# EAGLE design sensor_board008 (EAGLE 4.16)

## Sheet 1 of 2
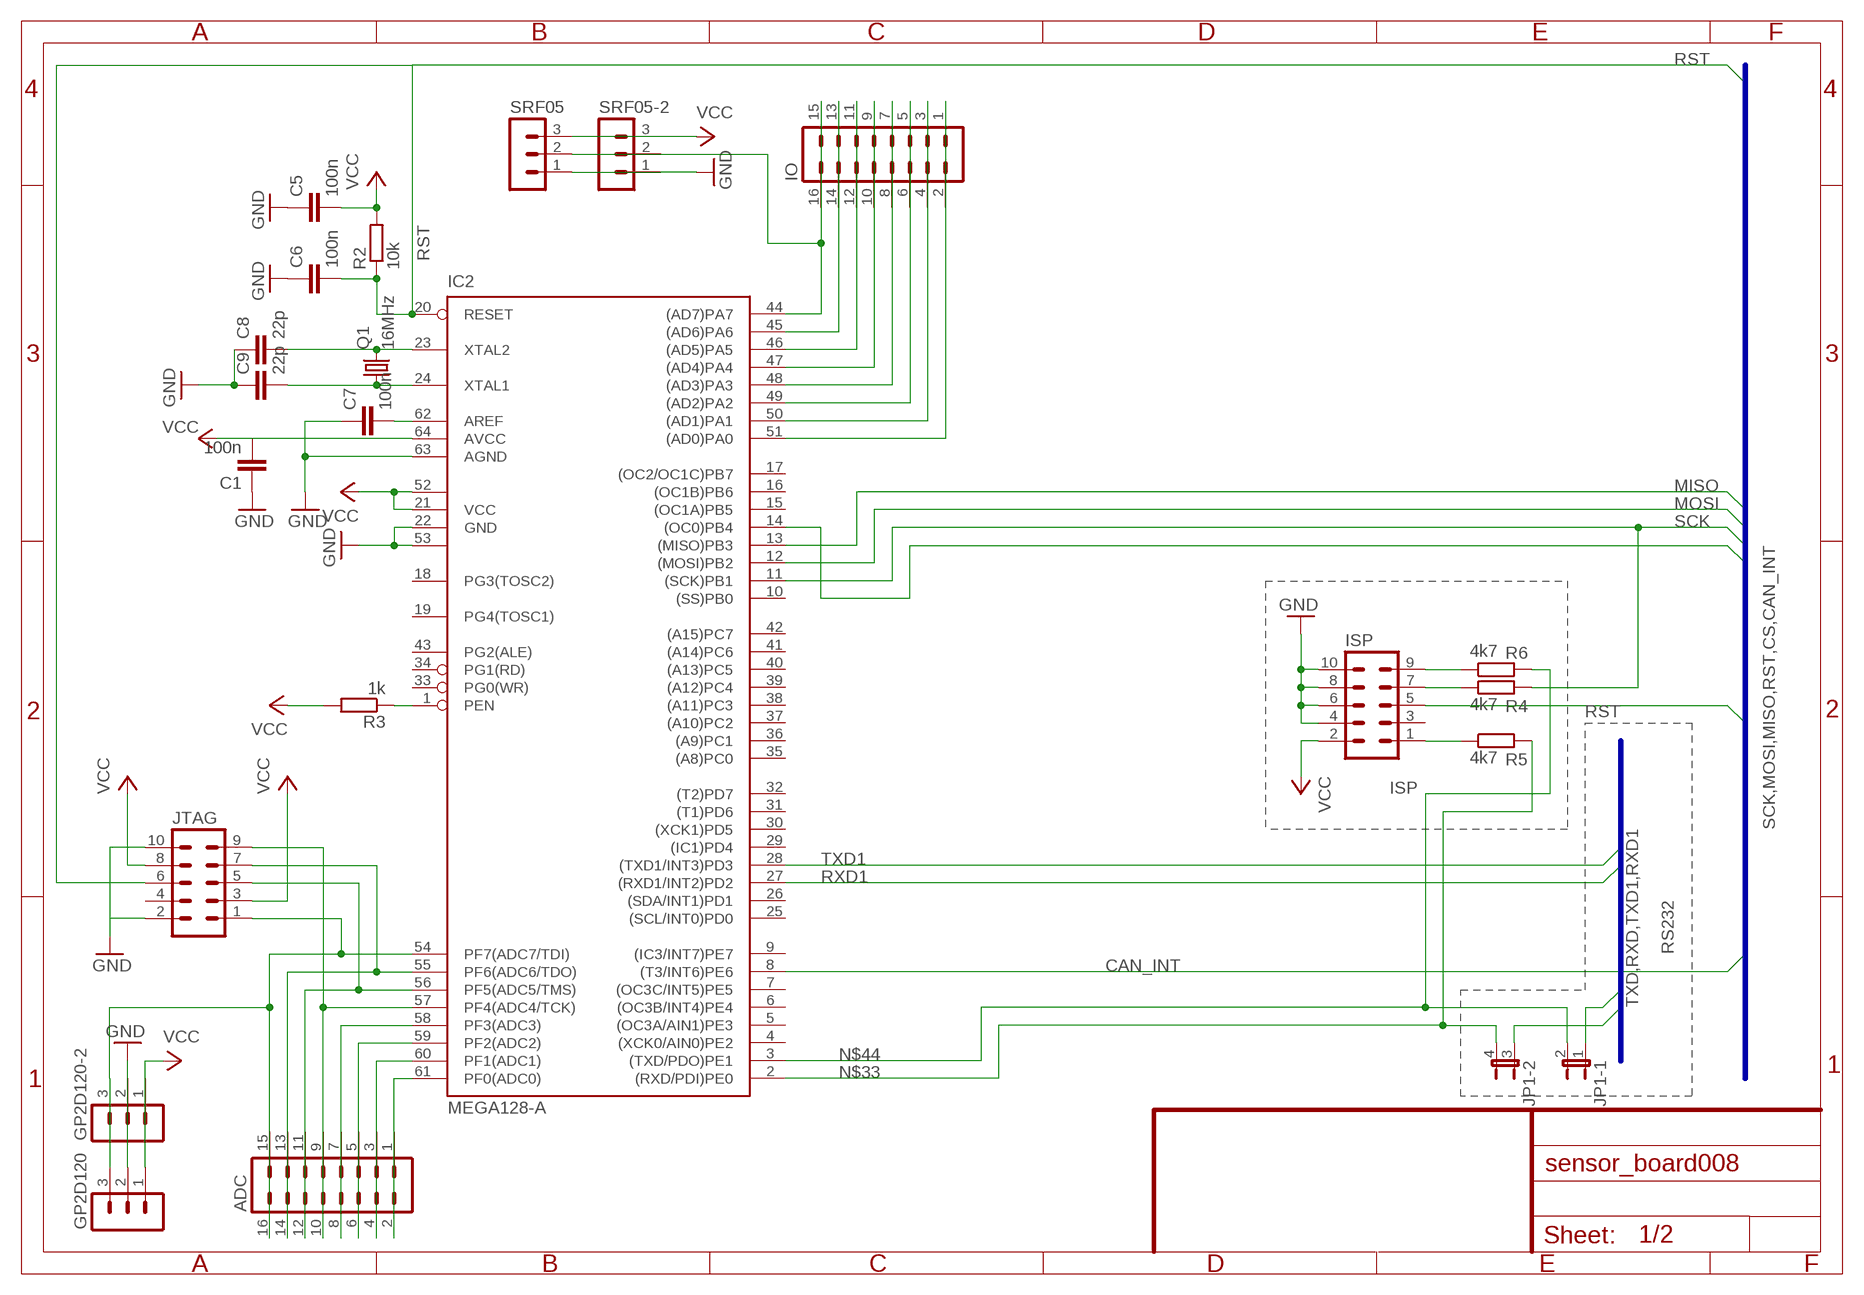
[diagram p0: schematic, sheet 1]

### Parts
ADC  MA08-2  [MA08-2]
C1  100n  C-EUC0603  [C0603]
C5  100n  C-EUC0603  [C0603]
C6  100n  C-EUC0603  [C0603]
C7  100n  C-EUC0603  [C0603]
C8  22p  C-EUC0603  [C0603]
C9  22p  C-EUC0603  [C0603]
GP2D120  MA03-1  [MA03-1]
GP2D120-2  MA03-1  [MA03-1]
IC2  MEGA128-A  [TQFP64]
IO  MA08-2  [MA08-2]
ISP  MA05-2  [MA05-2]
JP1  JP2QE  [JP2Q]
JTAG  MA05-2  [MA05-2]
Q1  16MHz  CRYSTALHC49U-V  [HC49U-V]
R2  10k  R-EU_R0805  [R0805]
R3  1k  R-EU_R0805  [R0805]
R4  4k7  R-EU_R0805  [R0805]
R5  4k7  R-EU_R0805  [R0805]
R6  4k7  R-EU_R0805  [R0805]
SRF05  MA03-1  [MA03-1]
SRF05-2  MA03-1  [MA03-1]

### Nets
CAN_INT: IC2.8((T3/INT6)PE6) ; also sheet 2
CS: IC2.14((OC0)PB4) ; also sheet 2
GND: C1.1 C5.1 C6.1 C7.1 C8.1 C9.1 GP2D120-2.2 GP2D120.2 IC2.22(GND) IC2.53(GND1) IC2.63(AGND) ISP.4 ISP.6 ISP.8 ISP.10 JTAG.2 JTAG.10 SRF05-2.1 SRF05.1 ; also sheet 2
MISO: IC2.13((MISO)PB3) ; also sheet 2
MOSI: IC2.12((MOSI)PB2) ; also sheet 2
N$1: ADC.1 ADC.2 IC2.61(PF0(ADC0))
N$3: ADC.3 ADC.4 IC2.60(PF1(ADC1))
N$4: ADC.5 ADC.6 IC2.59(PF2(ADC2))
N$5: C7.2 IC2.62(AREF)
N$6: C9.2 IC2.24(XTAL1) Q1.1
N$7: C8.2 IC2.23(XTAL2) Q1.2
N$9: ADC.7 ADC.8 IC2.58(PF3(ADC3))
N$11: ADC.9 ADC.10 IC2.57(PF4(ADC4/TCK)) JTAG.9
N$14: ADC.11 ADC.12 IC2.56(PF5(ADC5/TMS)) JTAG.5
N$15: ADC.13 ADC.14 IC2.55(PF6(ADC6/TDO)) JTAG.7
N$19: ADC.15 ADC.16 GP2D120-2.3 GP2D120.3 IC2.54(PF7(ADC7/TDI)) JTAG.1
N$20: IC2.45((AD6)PA6) IO.13 IO.14
N$22: ISP.9 R6.1
N$24: IC2.46((AD5)PA5) IO.11 IO.12
N$25: ISP.1 R5.1
N$26: IC2.1(PEN) R3.1
N$28: IC2.47((AD4)PA4) IO.9 IO.10
N$29: ISP.7 R4.1
N$31: IC2.48((AD3)PA3) IO.7 IO.8
N$32: IC2.49((AD2)PA2) IO.5 IO.6
N$33: IC2.2((RXD/PDI)PE0) JP1.4 R5.2
N$34: IC2.50((AD1)PA1) IO.3 IO.4
N$35: IC2.51((AD0)PA0) IO.1 IO.2
N$44: IC2.3((TXD/PDO)PE1) JP1.2 R6.2
N$47: IC2.44((AD7)PA7) IO.15 IO.16 SRF05-2.2 SRF05.2
RST: C6.2 IC2.20(RESET) ISP.5 JTAG.6 R2.1 ; also sheet 2
RXD: JP1.3 ; also sheet 2
RXD1: IC2.27((RXD1/INT2)PD2) ; also sheet 2
SCK: IC2.11((SCK)PB1) R4.2 ; also sheet 2
TXD: JP1.1 ; also sheet 2
TXD1: IC2.28((TXD1/INT3)PD3) ; also sheet 2
VCC: C1.2 C5.2 GP2D120-2.1 GP2D120.1 IC2.21(VCC) IC2.52(VCC1) IC2.64(AVCC) ISP.2 JTAG.3 JTAG.8 R2.2 R3.2 SRF05-2.3 SRF05.3 ; also sheet 2
Unconnected: IC2.4((XCK0/AIN0)PE2) IC2.5((OC3A/AIN1)PE3) IC2.6((OC3B/INT4)PE4) IC2.7((OC3C/INT5)PE5) IC2.9((IC3/INT7)PE7) IC2.10((SS)PB0) IC2.15((OC1A)PB5) IC2.16((OC1B)PB6) IC2.17((OC2/OC1C)PB7) IC2.18(PG3(TOSC2)) IC2.19(PG4(TOSC1)) IC2.25((SCL/INT0)PD0) IC2.26((SDA/INT1)PD1) IC2.29((IC1)PD4) IC2.30((XCK1)PD5) IC2.31((T1)PD6) IC2.32((T2)PD7) IC2.33(PG0(WR)) IC2.34(PG1(RD)) IC2.35((A8)PC0) IC2.36((A9)PC1) IC2.37((A10)PC2) IC2.38((A11)PC3) IC2.39((A12)PC4) IC2.40((A13)PC5) IC2.41((A14)PC6) IC2.42((A15)PC7) IC2.43(PG2(ALE)) ISP.3 JTAG.4

### Buses
SCK,MOSI,MISO,RST,CS,CAN_INT
TXD,RXD,TXD1,RXD1

### Notes on the sheet
- ISP
- RS232

## Sheet 2 of 2
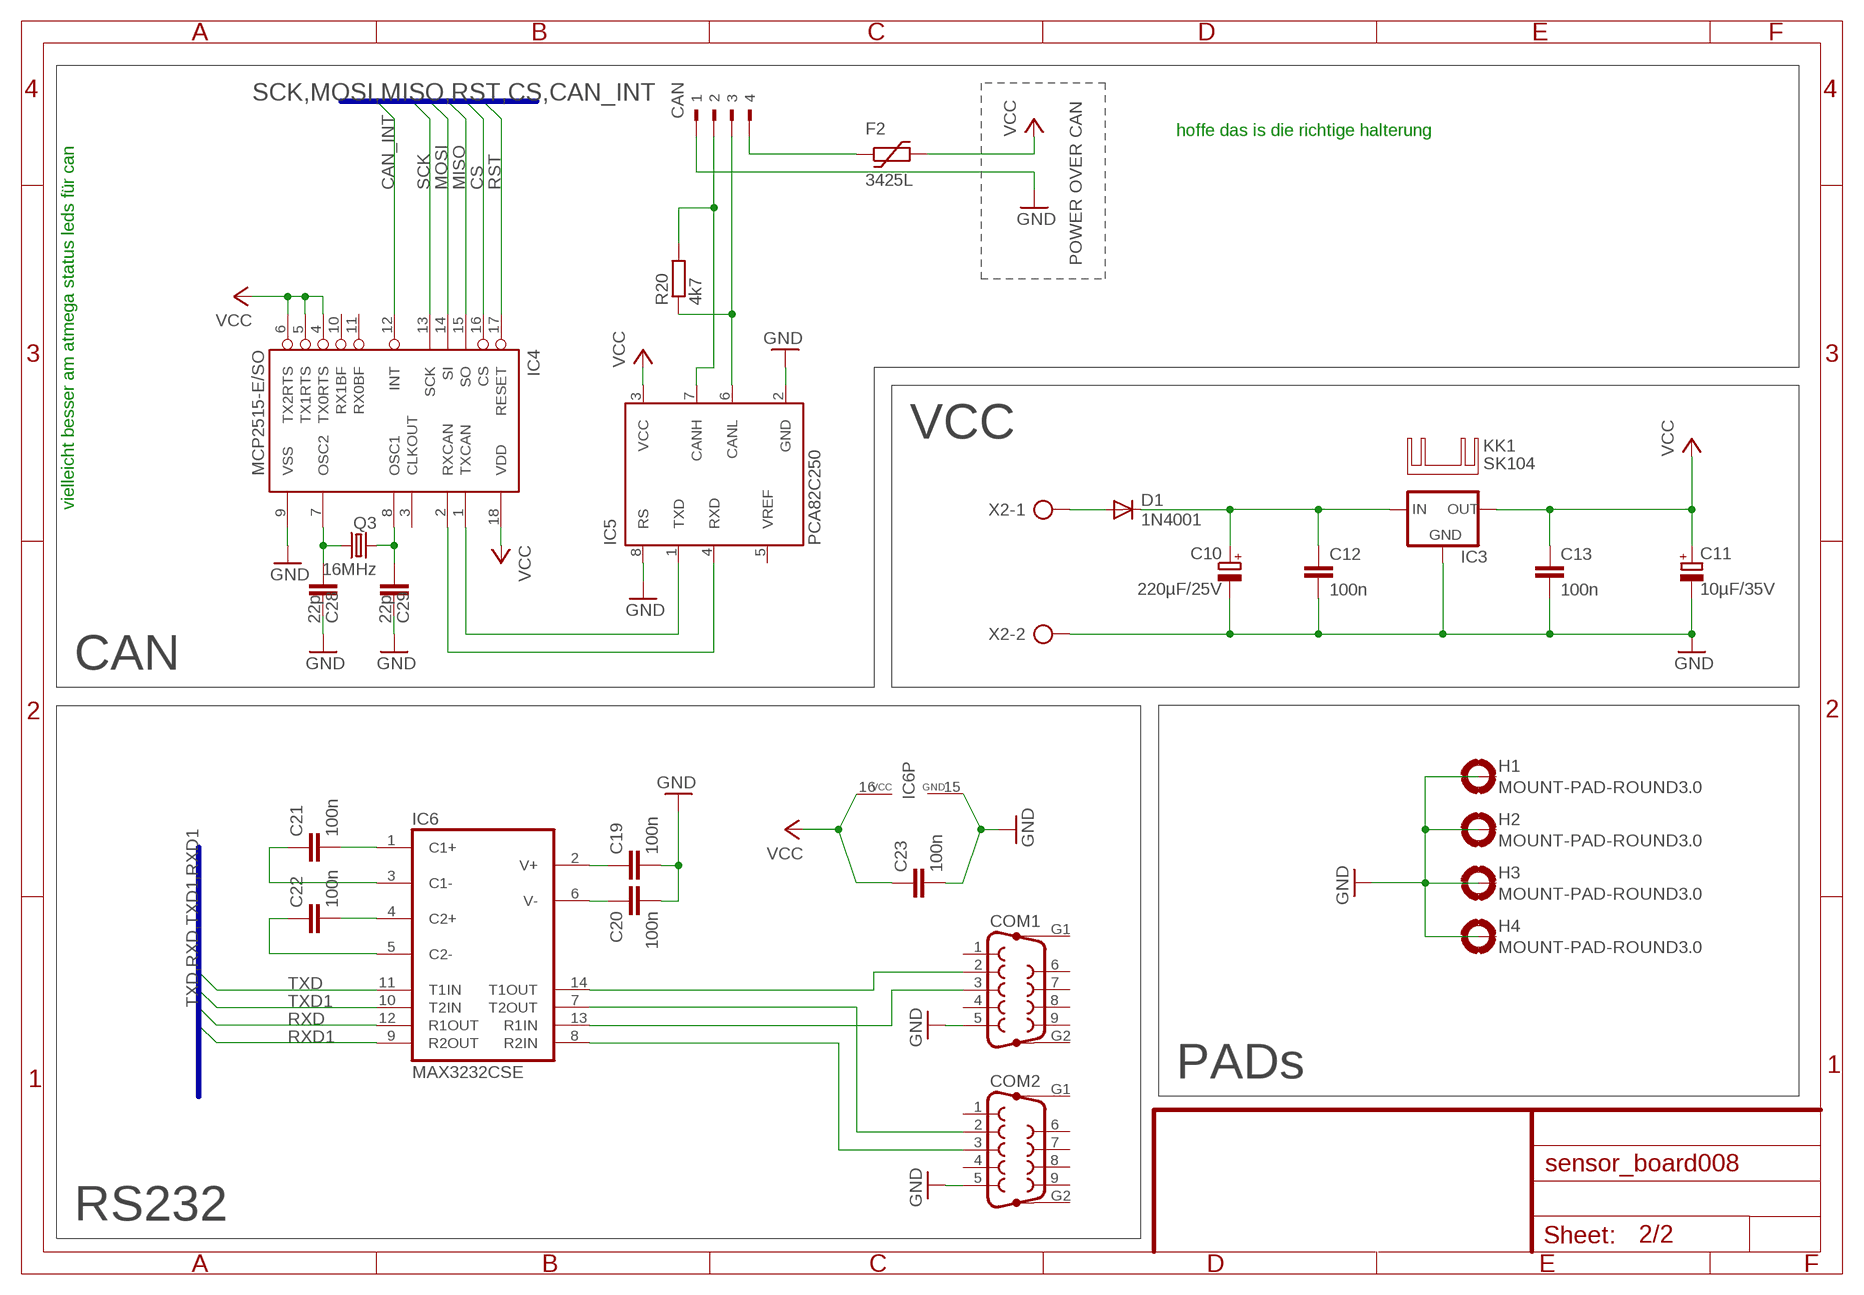
[diagram p1: schematic, sheet 2]

### Parts
C10  220µF/25V  CPOL-EUE3.5-8  [E3,5-8]
C11  10µF/35V  CPOL-EUE2-5  [E2-5]
C12  100n  C-EUC0603  [C0603]
C13  100n  C-EUC0603  [C0603]
C19  100n  C-EUC0603  [C0603]
C20  100n  C-EUC0603  [C0603]
C21  100n  C-EUC0603  [C0603]
C22  100n  C-EUC0603  [C0603]
C23  100n  C-EUC0603  [C0603]
C28  22p  C-EUC0603  [C0603]
C29  22p  C-EUC0603  [C0603]
CAN  90-4  [90-4]
COM1  F09HP  [F09HP]
COM2  F09HP  [F09HP]
D1  1N4001  DIODE-DO41-10  [DO41-10]
F2  3425L  [3425L]
H1  MOUNT-PAD-ROUND3.0  [3,0-PAD]
H2  MOUNT-PAD-ROUND3.0  [3,0-PAD]
H3  MOUNT-PAD-ROUND3.0  [3,0-PAD]
H4  MOUNT-PAD-ROUND3.0  [3,0-PAD]
IC3  78XXS  [78XXS]
IC4  MCP2515-E/SO  [SO18L]
IC5  PCA82C250  [DIL08]
IC6  MAX3232CSE  [SO16]
KK1  SK104  [SK104]
Q3  16MHz  CRYSTALHC49U-V  [HC49U-V]
R20  4k7  R-EU_R0805  [R0805]
X2  AK500/2-H  [AK500/2-H]

### Nets
CAN_INT: IC4.12(INT) ; also sheet 1
CS: IC4.16(CS) ; also sheet 1
GND: C10.- C11.- C12.2 C13.2 C19.2 C20.2 C23.2 C28.2 C29.2 CAN.1 COM1.5 COM2.5 H1.B3,0(MOUNT) H2.B3,0(MOUNT) H3.B3,0(MOUNT) H4.B3,0(MOUNT) IC3.GND IC4.9(VSS) IC5.2(GND) IC5.8(RS) IC6.15(GND) X2.2 ; also sheet 1
MISO: IC4.15(SO) ; also sheet 1
MOSI: IC4.14(SI) ; also sheet 1
N$2: IC4.1(TXCAN) IC5.1(TXD)
N$8: C10.+ C12.1 D1.C IC3.IN
N$10: D1.A X2.1
N$12: COM1.2 IC6.14(T1OUT)
N$13: COM1.3 IC6.13(R1IN)
N$16: CAN.4 F2.P$1
N$17: C21.2 IC6.1(C1+)
N$21: IC4.2(RXCAN) IC5.4(RXD)
N$23: CAN.3 IC5.6(CANL) R20.1
N$30: C22.2 IC6.4(C2+)
N$36: C22.1 IC6.5(C2-)
N$37: C21.1 IC6.3(C1-)
N$40: COM2.2 IC6.7(T2OUT)
N$41: COM2.3 IC6.8(R2IN)
N$43: C19.1 IC6.2(V+)
N$46: C20.1 IC6.6(V-)
N$53: C28.1 IC4.7(OSC2) Q3.1
N$54: C29.1 IC4.8(OSC1) Q3.2
N$59: CAN.2 IC5.7(CANH) R20.2
RST: IC4.17(RESET) ; also sheet 1
RXD: IC6.12(R1OUT) ; also sheet 1
RXD1: IC6.9(R2OUT) ; also sheet 1
SCK: IC4.13(SCK) ; also sheet 1
TXD: IC6.11(T1IN) ; also sheet 1
TXD1: IC6.10(T2IN) ; also sheet 1
VCC: C11.+ C13.1 C23.1 F2.P$2 IC3.OUT IC4.4(TX0RTS) IC4.5(TX1RTS) IC4.6(TX2RTS) IC4.18(VDD) IC5.3(VCC) IC6.16(VCC) ; also sheet 1
Unconnected: COM1.1 COM1.4 COM1.6 COM1.7 COM1.8 COM1.9 COM1.G1 COM1.G2 COM2.1 COM2.4 COM2.6 COM2.7 COM2.8 COM2.9 COM2.G1 COM2.G2 IC4.3(CLKOUT) IC4.10(RX1BF) IC4.11(RX0BF) IC5.5(VREF)

### Buses
SCK,MOSI,MISO,RST,CS,CAN_INT
TXD,RXD,TXD1,RXD1

### Notes on the sheet
- POWER OVER CAN
- hoffe das is die richtige halterung
- VCC
- vielleicht besser am atmega status leds für can
- CAN
- PADs
- RS232

## Library data of the parts
ADC IO = con-lstb:MA08-2: PIN HEADER
C1 C5-C9 C12 C13 C19-C23 C28 C29 = rcl:C-EU: CAPACITOR, European symbol
C10 C11 = rcl:CPOL-EU: POLARIZED CAPACITOR, European symbol
CAN = con-weidmueller-sl35:90-4: WEIDMUELLER CLAMP CONNECTOR
COM1 COM2 = con-subd:F09HP: SUB-D
D1 = diode:DIODE-: DIODE
F2 = ptc-littlefuse:3425L
GP2D120 GP2D120-2 SRF05 SRF05-2 = con-lstb:MA03-1: PIN HEADER
H1-H4 = holes:MOUNT-PAD-ROUND: MOUNTING PAD, round
IC2 = atmel:MEGA128: MICROCONTROLLER 128 Kbytes FLASH 4 Kbytes SRAM 4 Kbytes EEPROM DUAL USART 8-channel 10 bit ADC Source: avr.lbr
IC3 = v-reg:78XXS: VOLTAGE REGULATOR
IC4 = mcp2515:MCP2515
IC5 = micro-philips:PCA82C250: CAN CONTROLLER INTERFACE
IC6 = maxim:MAX3232*: True RS-232 Transceivers 3.0V to 5.5V, Low-Power up to 1Mbps, Using Four 0.1µF External Capacitors Source: http://pdfserv.maxim-ic.com/en/ds/MAX3222-MAX3241.pdf
ISP JTAG = con-lstb:MA05-2: PIN HEADER
JP1 = jumper:JP2QE: JUMPER
KK1 = heatsink:SK104: HEATSINK manufacturer Fischer/distributor Buerklin
Q1 Q3 = crystal:CRYSTAL: CRYSTAL
R2-R6 R20 = rcl:R-EU_: RESISTOR, European symbol
X2 = con-ptr500:AK500/2-H: CONNECTOR Aug. 2004 / PTR Meßtechnik: Die Bezeichnung der Serie AK505 wurde geändert. Es handelt sich hierbei um AK500 in horizontaler Ausführung.

## Board
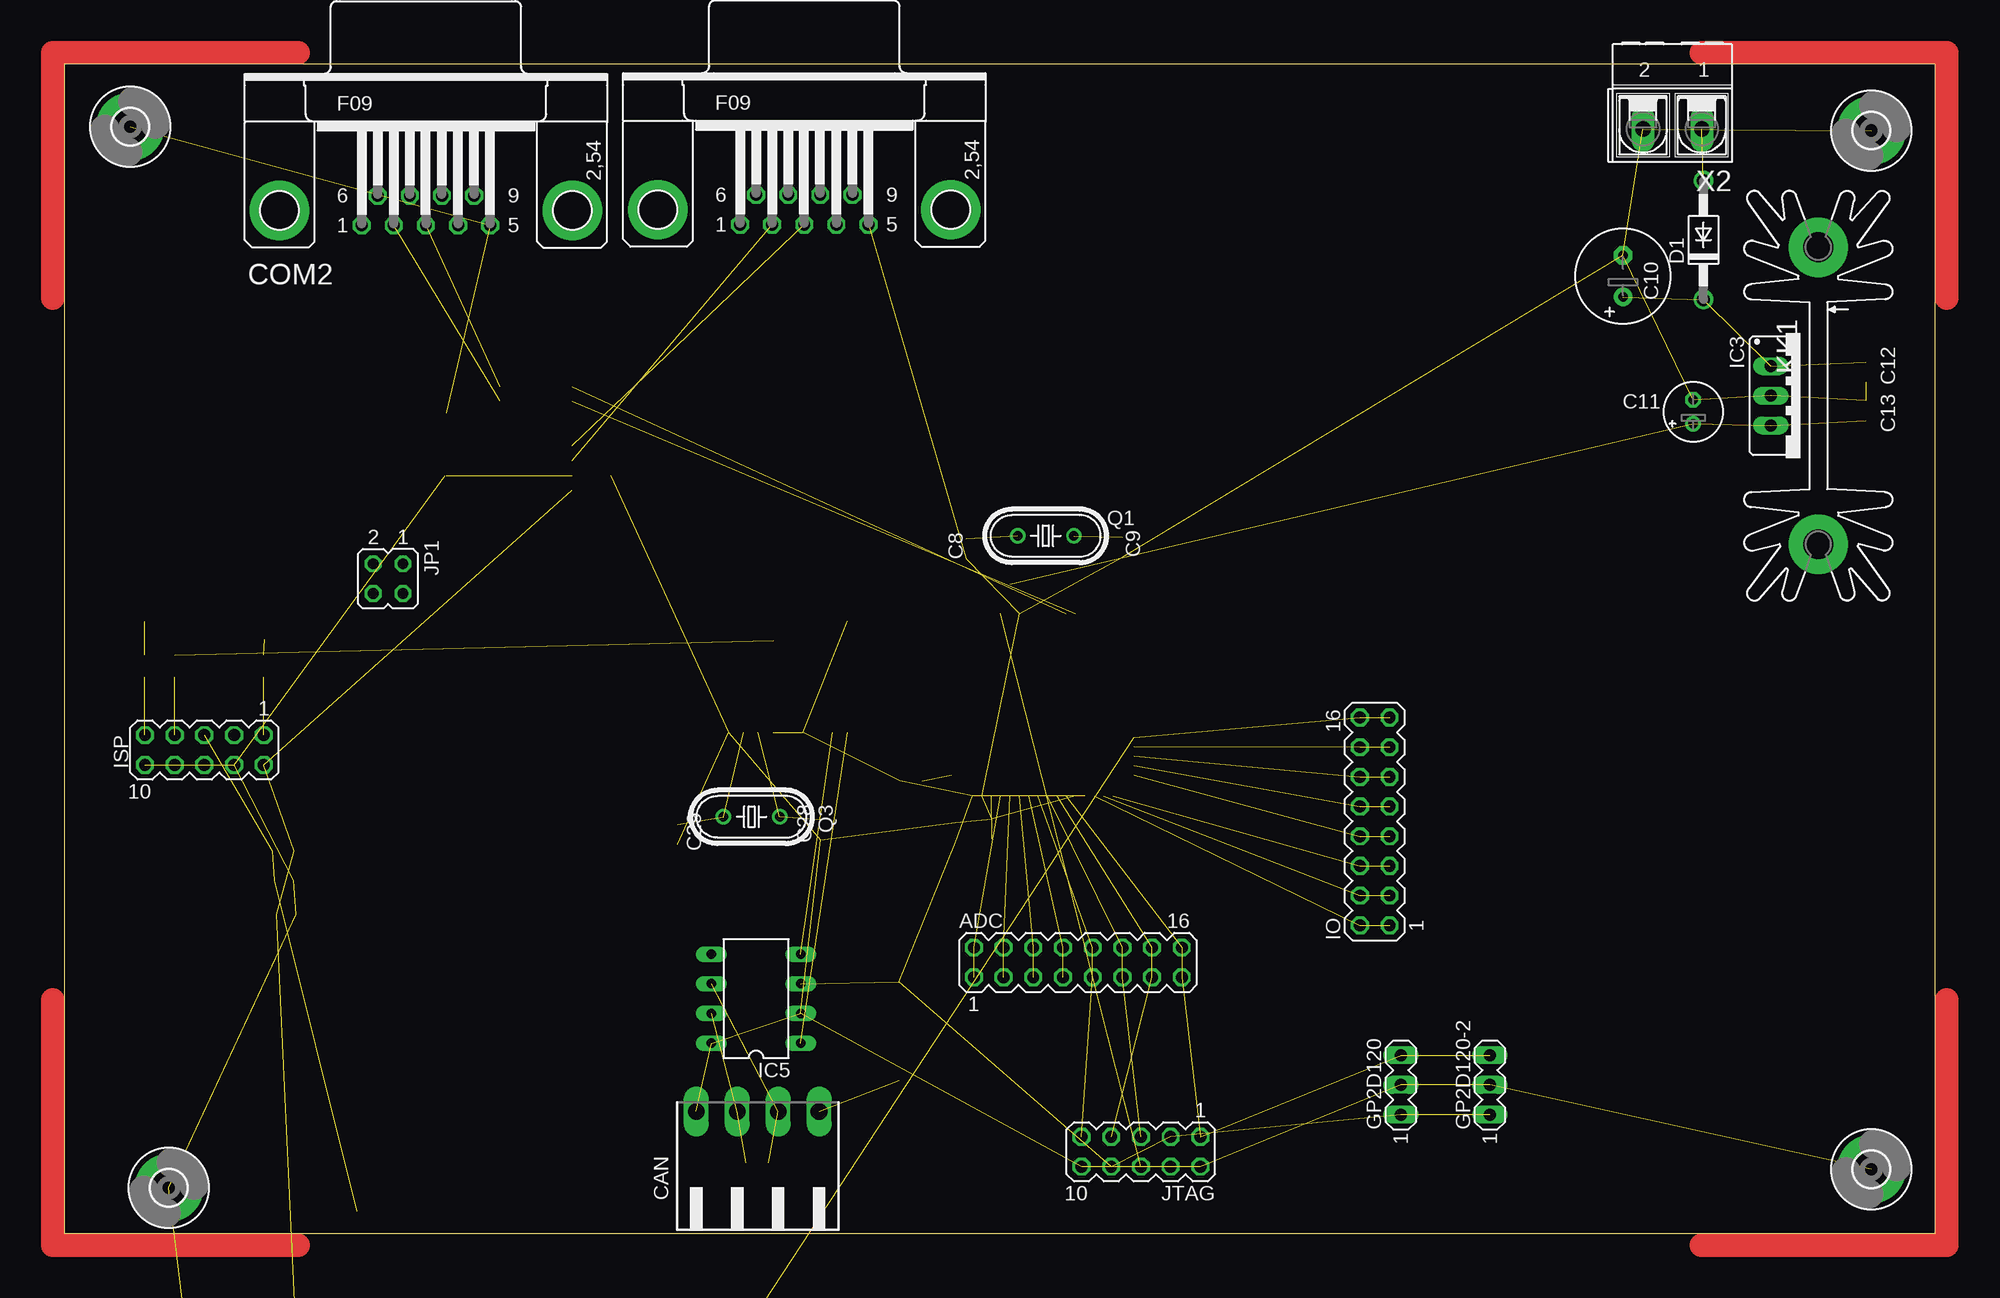
[diagram p2: board, top side]
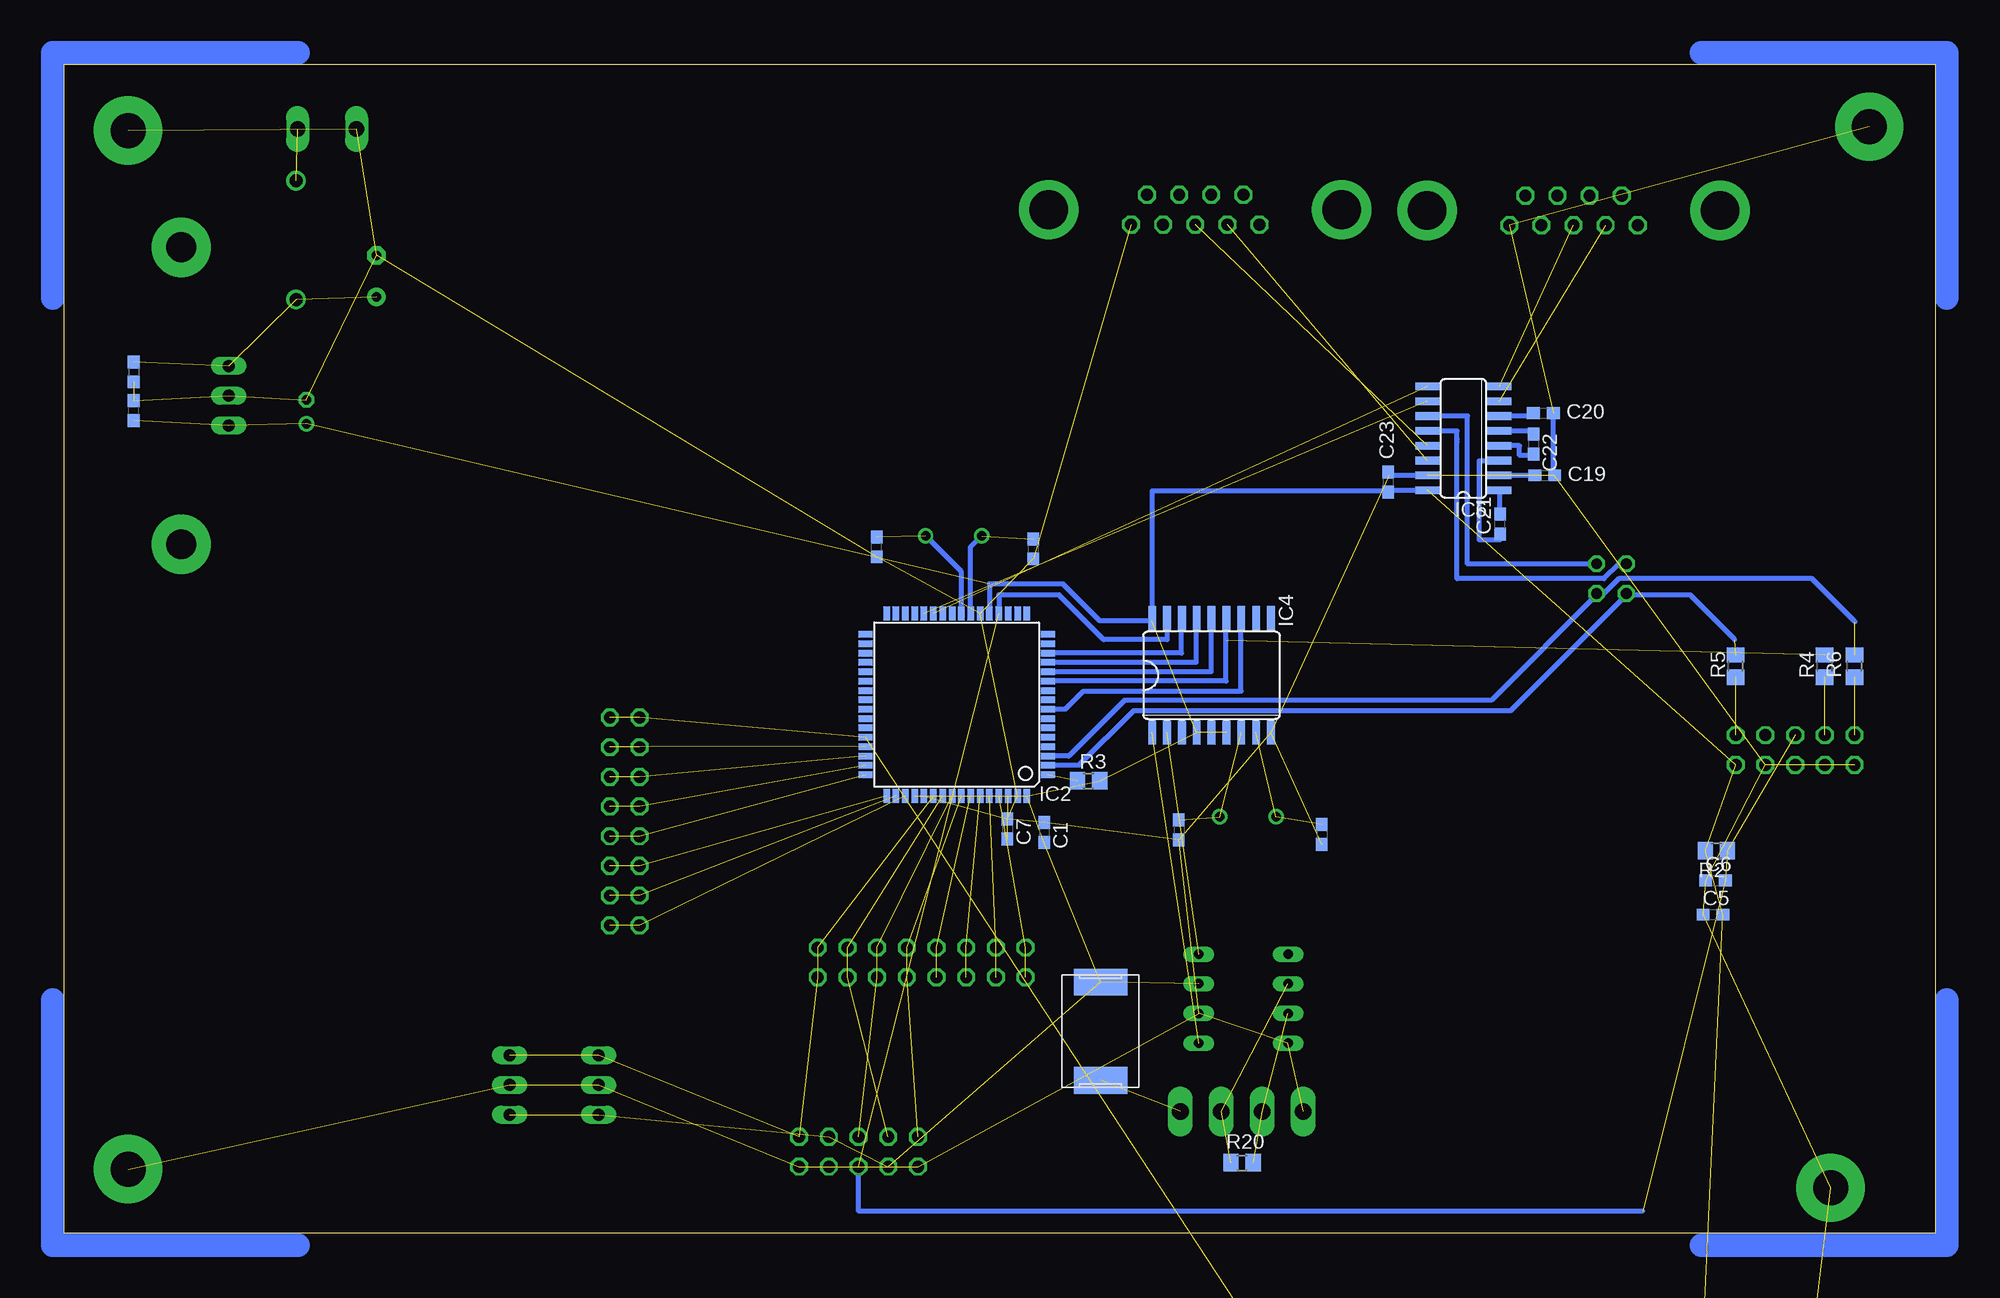
[diagram p3: board, bottom side, seen from below]

Size 160 x 100 mm. Coordinates in mm from the lower left corner, seen from the top.
Outline: 0,0 160,0 160,100 0,100 0,0
Copper layers (1*16): Top 0.035mm / dielectric 1.5mm / Bottom 0.035mm
Design rules "olimex_8mils": minimum track width 10mil, minimum drill 24mil, track to track 8mil, track to pad 8mil, pad to pad 8mil, via to via 8mil, smd to smd 8mil, copper to edge 40mil, drill to drill 10mil, minimum pad ring 10mil, minimum via ring 8mil, stop-mask expansion 0mil, vias tented up to drill 0mil, thermal gap 10mil

### Footprints (pad centres in the part's own frame; a part is rotated, then mirrored left to right if it is on the bottom)
MA08-2 = drill 1.016 octagon: 1 -8.89,-1.27; 2 -8.89,1.27; 3 -6.35,-1.27; 4 -6.35,1.27; 5 -3.81,-1.27; 6 -3.81,1.27; 7 -1.27,-1.27; 8 -1.27,1.27; 9 1.27,-1.27; 10 1.27,1.27; 11 3.81,-1.27; 12 3.81,1.27; 13 6.35,-1.27; 14 6.35,1.27; 15 8.89,-1.27; 16 8.89,1.27
C0603 = smd 1.1 x 1: 1 -0.85,0; 2 0.85,0
E3,5-8 = drill 0.813 pad 1.6 round: + -1.778,0 | drill 0.813 pad 1.6 octagon: - 1.778,0
E2-5 = drill 0.813 pad 1.27 round: + -1.016,0 | drill 0.813 pad 1.27 octagon: - 1.016,0
90-4 = drill 1.422 long: 1 -5.25,5.25; 2 -1.75,5.25; 3 1.75,5.25; 4 5.25,5.25
F09HP = drill 1.016 octagon: 1 -5.486,-1.27; 2 -2.743,-1.27; 3 0,-1.27; 4 2.743,-1.27; 5 5.486,-1.27; 6 -4.115,1.27; 7 -1.372,1.27; 8 1.372,1.27; 9 4.115,1.27 | drill 3.302 pad 5.08 round: G1 -12.522,0; G2 12.522,0
DO41-10 = drill 1.118 round: A 5.08,0; C -5.08,0
3425L = smd 2.29 x 4.57: P$1 -4.2,0; P$2 4.2,0
MA03-1 = drill 1.016 long: 1 -2.54,0; 2 0,0; 3 2.54,0
3,0-PAD = drill 3 pad 5.842 round: B3,0 0,0
TQFP64 = smd 1.194 x 0.559: 1 -7.8,6; 2 -7.8,5.2; 3 -7.8,4.4; 4 -7.8,3.6; 5 -7.8,2.8; 6 -7.8,2; 7 -7.8,1.2; 8 -7.8,0.4; 9 -7.8,-0.4; 10 -7.8,-1.2; 11 -7.8,-2; 12 -7.8,-2.8; 13 -7.8,-3.6; 14 -7.8,-4.4; 15 -7.8,-5.2; 16 -7.8,-6; 33 7.8,-6; 34 7.8,-5.2; 35 7.8,-4.4; 36 7.8,-3.6; 37 7.8,-2.8; 38 7.8,-2; 39 7.8,-1.2; 40 7.8,-0.4; 41 7.8,0.4; 42 7.8,1.2; 43 7.8,2; 44 7.8,2.8; 45 7.8,3.6; 46 7.8,4.4; 47 7.8,5.2; 48 7.8,6 | smd 0.559 x 1.194: 17 -6,-7.8; 18 -5.2,-7.8; 19 -4.4,-7.8; 20 -3.6,-7.8; 21 -2.8,-7.8; 22 -2,-7.8; 23 -1.2,-7.8; 24 -0.4,-7.8; 25 0.4,-7.8; 26 1.2,-7.8; 27 2,-7.8; 28 2.8,-7.8; 29 3.6,-7.8; 30 4.4,-7.8; 31 5.2,-7.8; 32 6,-7.8; 49 6,7.8; 50 5.2,7.8; 51 4.4,7.8; 52 3.6,7.8; 53 2.8,7.8; 54 2,7.8; 55 1.2,7.8; 56 0.4,7.8; 57 -0.4,7.8; 58 -1.2,7.8; 59 -2,7.8; 60 -2.8,7.8; 61 -3.6,7.8; 62 -4.4,7.8; 63 -5.2,7.8; 64 -6,7.8
78XXS = drill 1.016 long: GND 0,-2.54; IN -2.54,-2.54; OUT 2.54,-2.54
SO18L = smd 0.66 x 2.032: 1 -5.08,-4.902; 2 -3.81,-4.902; 3 -2.54,-4.902; 4 -1.27,-4.902; 5 0,-4.902; 6 1.27,-4.902; 7 2.54,-4.902; 8 3.81,-4.902; 9 5.08,-4.902; 10 5.08,4.902; 11 3.81,4.902; 12 2.54,4.902; 13 1.27,4.902; 14 0,4.902; 15 -1.27,4.902; 16 -2.54,4.902; 17 -3.81,4.902; 18 -5.08,4.902
DIL08 = drill 0.813 long: 1 -3.81,-3.81; 2 -1.27,-3.81; 3 1.27,-3.81; 4 3.81,-3.81; 5 3.81,3.81; 6 1.27,3.81; 7 -1.27,3.81; 8 -3.81,3.81
SO16 = smd 0.66 x 2.032: 1 -4.445,-3.073; 2 -3.175,-3.073; 3 -1.905,-3.073; 4 -0.635,-3.073; 5 0.635,-3.073; 6 1.905,-3.073; 7 3.175,-3.073; 8 4.445,-3.073; 9 4.445,3.073; 10 3.175,3.073; 11 1.905,3.073; 12 0.635,3.073; 13 -0.635,3.073; 14 -1.905,3.073; 15 -3.175,3.073; 16 -4.445,3.073
MA05-2 = drill 1.016 octagon: 1 -5.08,-1.27; 2 -5.08,1.27; 3 -2.54,-1.27; 4 -2.54,1.27; 5 0,-1.27; 6 0,1.27; 7 2.54,-1.27; 8 2.54,1.27; 9 5.08,-1.27; 10 5.08,1.27
JP2Q = drill 0.914 octagon: 1 -1.27,-1.27; 2 -1.27,1.27; 3 1.27,-1.27; 4 1.27,1.27
SK104 = drill 2.54 pad 5.08 round: A2,5 -12.7,-0.762; B2,5 12.7,-0.762
HC49U-V = drill 0.813 round: 1 -2.413,0; 2 2.413,0
R0805 = smd 1.3 x 1.5: 1 -0.95,0; 2 0.95,0
AK500/2-H = drill 1.321 long: 1 -2.515,0; 2 2.515,0

### Placement (x,y rotation side)
ADC  86.68,23.18 0 top
C1  76.2,34.29 270 bottom
C5  19,27.28 0 bottom
C6  18.78,30.19 0 bottom
C7  79.35,34.59 270 bottom
C8  77.13,58.56 90 bottom
C9  90.51,58.72 90 bottom
C10  133.3,81.88 90 top
C11  139.31,70.27 90 top
C12  154.06,73.69 270 bottom
C13  154.06,70.38 90 bottom
C19  33.4,64.83 0 bottom
C20  33.52,70.17 0 bottom
C21  37.21,60.67 90 bottom
C22  34.35,67.53 270 bottom
C23  46.77,64.26 90 bottom
C28  64.69,34.52 270 bottom
C29  52.46,34.12 270 bottom
CAN  59.3,5.18 0 top
COM1  63.28,87.57 0 top
COM2  30.92,87.5 0 top
D1  140.18,84.96 90 top
F2  71.37,17.3 90 bottom
GP2D120  114.3,12.7 90 top
GP2D120-2  121.92,12.7 90 top
H1  154.55,5.5 0 top
H2  5.64,94.67 0 top
H3  8.94,3.91 0 top
H4  154.55,94.34 0 top
IC2  83.68,45.24 180 bottom
IC3  148.48,71.65 270 top
IC4  61.89,47.74 0 bottom
IC5  59.16,20.08 90 top
IC6  40.35,68.01 90 bottom
IO  112.08,35.24 90 top
ISP  11.98,41.35 180 top
JP1  27.69,56.01 180 top
JTAG  92.08,6.99 180 top
KK1  150.76,71.65 270 top
Q1  83.93,59.66 180 top
Q3  58.78,35.64 180 top
R2  18.72,32.73 180 bottom
R3  72.4,38.71 0 bottom
R4  9.45,48.53 90 bottom
R5  17.07,48.53 90 bottom
R6  6.9,48.53 90 bottom
R20  59.27,6.05 0 bottom
SRF05  20,-66.67 0 top  (outside the outline)
SRF05-2  20,-73.98 0 top  (outside the outline)
X2  137.53,94.46 180 top

### Tracks (layer width: path | path; a pad name or v marks a point on that pad's centre or on a via)
CAN_INT
  Bottom 0.406: 59.37,50.74 59.37,50.8 | 59.37,50.74 IC4.12 | IC2.8 74.42,44.84 72.9,46.35 59.37,46.36 59.37,50.74
CS
  Bottom 0.406: 64.45,51.69 64.45,51.75 | 64.45,51.69 IC4.16 | IC2.14 64.45,49.64 64.45,51.69
GND  (38 unrouted)
  Bottom 0.406: C20.2 32.64,70.17 32.64,64.83 C19.2 | C23.2 46.74,65.11 46.74,64.83 IC6.15
  pour Top (isolate 0.254): -79.65,78.66 -20.99,77.47 -20.89,0.58 -79.55,1.96
  pour Bottom (isolate 0.254): -37.87,77.76 -60.31,78.08 -60.36,1.14 -37.85,0.8
MISO
  Bottom 0.406: 63.18,50.74 63.18,50.8 | 63.18,50.74 IC4.15 | IC2.13 63.18,48.84 63.18,50.74
MOSI
  Bottom 0.406: 61.91,50.74 61.91,50.8 | 61.91,50.74 IC4.14 | IC2.12 61.91,48.04 61.91,50.74
N$1  (2 unrouted)
N$2  (1 unrouted)
N$3  (2 unrouted)
N$4  (2 unrouted)
N$5  (1 unrouted)
N$6  (1 unrouted)
  Bottom 0.406: 86.35,59.68 86.36,59.69 | 86.35,59.68 Q1.1 | IC2.24 83.28,56.61 86.35,59.68
N$7  (1 unrouted)
  Bottom 0.406: Q1.2 81.52,59.68 81.53,59.69 82.48,58.74 IC2.23
N$8  (3 unrouted)
N$9  (2 unrouted)
N$10  (1 unrouted)
N$11  (3 unrouted)
N$12  (1 unrouted)
N$13  (1 unrouted)
N$14  (3 unrouted)
N$15  (3 unrouted)
N$16  (1 unrouted)
N$17
  Bottom 0.406: IC6.1 37.21,63.56 C21.2
N$18
  Top 2: 20,-1 -1,-1 -1,20
N$19  (5 unrouted)
N$20  (2 unrouted)
N$21  (1 unrouted)
N$22  (1 unrouted)
N$23  (2 unrouted)
N$24  (2 unrouted)
N$25  (1 unrouted)
N$26  (1 unrouted)
N$28  (2 unrouted)
N$29  (1 unrouted)
N$30
  Bottom 0.406: IC6.4 35.56,67.37 35.56,66.55 34.42,66.55 34.42,66.68 C22.2
N$31  (2 unrouted)
N$32  (2 unrouted)
N$33  (1 unrouted)
  Bottom 0.406: IC2.2 73.25,40.04 68.58,44.7 36.32,44.7 26.42,54.61 | 26.42,54.61 JP1.4 | 26.42,54.61 20.95,54.61 17.14,50.8
N$34  (2 unrouted)
N$35  (2 unrouted)
N$36
  Bottom 0.406: C22.1 34.42,68.38 34.42,68.64 IC6.5
N$37
  Bottom 0.406: IC6.3 38.99,66.1 38.99,59.31 37.21,59.31 C21.1
N$39
  Top 2: 140,-1 161,-1 161,20
N$40  (1 unrouted)
N$41  (1 unrouted)
N$43
  Bottom 0.406: C19.1 34.16,64.83 | 34.16,64.83 IC6.2 | 34.16,64.83 34.16,64.9
N$44  (1 unrouted)
  Bottom 0.406: IC2.3 74.1,40.84 69.34,45.59 37.97,45.59 28.83,54.74 | 28.83,54.74 JP1.2 | 28.83,54.74 28.32,54.74 27.05,56.01 10.54,56.01 6.86,52.32
N$45
  Top 2: 20,101 -1,101 -1,80
N$46
  Bottom 0.406: 34.42,70.17 34.42,70.23 | C20.1 34.42,70.17 | IC6.6 34.42,69.91 34.42,70.17
N$47  (4 unrouted)
N$51
  Top 2: 161,80 161,101 140,101
N$53  (2 unrouted)
N$54  (2 unrouted)
N$55
  Bottom 2: 20,-1 -1,-1 -1,20
N$56
  Bottom 2: 140,-1 161,-1 161,20
N$57
  Bottom 2: 20,101 -1,101 -1,80
N$58
  Bottom 2: 161,80 161,101 140,101
N$59  (2 unrouted)
RST  (4 unrouted)
  Bottom 0.406: IC4.17 65.7,50.8 71.12,50.8 74.93,54.61 80.08,54.61 IC2.20 | JTAG.6 92.08,1.91 25.02,1.91
RXD
  Bottom 0.406: JP1.3 27.05,57.28 28.32,56.01 40.89,56.01 40.89,67.69 | 40.89,67.69 40.89,67.94 | IC6.12 40.89,68.64 40.89,67.69
RXD1  (1 unrouted)
SCK  (1 unrouted)
  Bottom 0.406: 60.64,50.74 60.64,50.8 | 60.64,50.74 IC4.13 | IC2.11 60.64,47.24 60.64,50.74
TXD
  Bottom 0.406: IC6.11 40.01,69.91 40.01,57.28 JP1.1
TXD1  (1 unrouted)
VCC  (21 unrouted)
  Bottom 0.406: IC2.21 80.88,55.56 74.61,55.56 71.44,52.39 66.99,52.39 66.97,52.41 IC4.18 66.97,63.5 46.74,63.5 | IC6.16 46.74,63.56 46.74,63.5 | 46.74,63.5 46.74,63.41 C23.1 46.77,63.5 46.74,63.5